# Altium project PowerPCB.PrjPcb
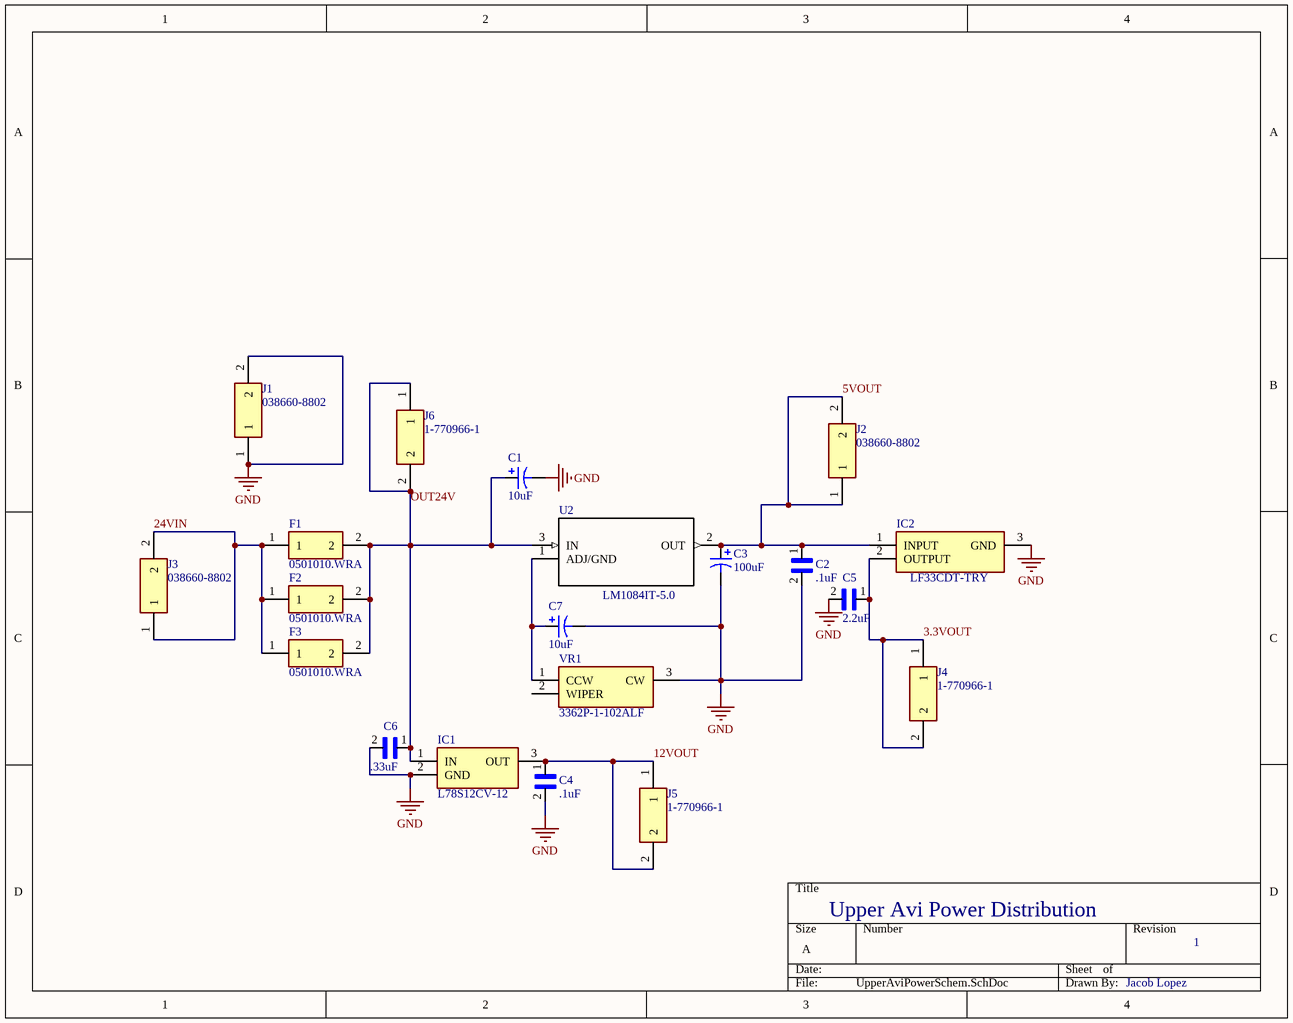
[diagram p0: UpperAviPowerSchem.SchDoc]
1 sheet, 20 parts. Net scope: global (net labels, ports and power ports of the same name join across sheets).
Board file: UpperAvi_3.PcbDoc

## Sheet UpperAviPowerSchem.SchDoc
size A

### Parts
C1  value 10uF  [CAPR5-4X5]  (hidden comment: Cap Pol3)
C2  .1uF  [6-0805_M]
C3  value 100uF  [CAPR5-4X5]  (hidden comment: Cap Pol3)
C4  .1uF  [6-0805_M]
C5  2.2uF  [6-0805_M]
C6  .33uF  [6-0805_M]
C7  value 10uF  [CAPR5-4X5]  (hidden comment: Cap Pol3)
F1  0501010.WRA  [FUSC3216X98N]
F2  0501010.WRA  [FUSC3216X98N]
F3  0501010.WRA  [FUSC3216X98N]
IC1  L78S12CV-12  [TO270P460X1020X2008-3P]
IC2  LF33CDT-TRY  [LD1117DT33]
J1  038660-8802  [0386608802]
J2  038660-8802  [0386608802]
J3  038660-8802  [0386608802]
J4  1-770966-1  [17709661]
J5  1-770966-1  [17709661]
J6  1-770966-1  [17709661]
U2  LM1084IT-5.0  [*TO254P470X1016X2222-3P]
VR1  3362P-1-102ALF  [3362P_1]

### Nets
GND: C1.2 C2.2 C3.2 C4.2 C5.2 C6.2 C7.2 IC1.2(GND) IC2.3(GND) J1.1 J1.2 VR1.3(CW)
3.3VOUT: C5.1 IC2.2(OUTPUT) J4.1 J4.2
5VOUT: C2.1 C3.1 IC2.1(INPUT) J2.1 J2.2 U2.2(OUT)
12VOUT: C4.1 IC1.3(OUT) J5.1 J5.2
24VIN: F1.1 F2.1 F3.1 J3.1 J3.2
OUT24V: C1.1 C6.1 F1.2 F2.2 F3.2 IC1.1(IN) J6.1 J6.2 U2.3(IN)
NetC7_1: C7.1 U2.1(ADJ/GND) VR1.1(CCW)

Not connected (* = marked no-connect by the designer): VR1 2(WIPER)

### Notes on the sheet
- Upper Avi Power Distribution
- 1
- Jacob Lopez

### Library data of the parts
C1 C3 C7 = Cap Pol3: Polarized Capacitor (Surface Mount); Published: 8-Jun-2000; LatestRevisionDate: 29-May-2009; LatestRevisionNote: IPC-7351 Footprint Added.; PackageReference: C0805; Publisher: Altium Limited; PackageDescription: Chip Capacitor
C2 C4-C6 = CC0603KRX7R9BB104: 0603 0.1 uF 50 V Â±10 % Tolerance X7R SMT Multilayer Ceramic Capacitor; MF: Yageo; Price: None; Availability: Unavailable; MP: CC0603KRX7R9BB104; Package: 0603 Yageo; SnapEDA_Link: https://www.snapeda.com/parts/CC0603KRX7R9BB104/Yageo/view-part/?ref=snap; Value: *
F1-F3 = 0501010.WRA: Fuse; Manufacturer_Name: LITTELFUSE; Datasheet Link: https://www.littelfuse.com/~/media/electronics/datasheets/fuses/littelfuse_fuse_501_datasheet.pdf.pdf; Height: 0.985mm; Manufacturer_Part_Number: 0501010.WRA; Mouser Part Number: 576-0501010.WRA; Mouser Price/Stock: https://www.mouser.com/Search/Refine.aspx?Keyword=576-0501010.WRA
IC1 = L78S12CV: Integrated Circuit; Manufacturer_Name: STMicroelectronics; Datasheet Link: https://componentsearchengine.com/Datasheets/1/L78S12CV.pdf; Height: 4.6mm; Mouser Part Number: 511-L78S12CV; Mouser Price/Stock: https://www.mouser.com/Search/Refine.aspx?Keyword=511-L78S12CV; Manufacturer_Part_Number: L78S12CV
IC2 = LF33CDT-TRY: Integrated Circuit; Manufacturer_Name: STMicroelectronics; Datasheet Link: https://componentsearchengine.com/Datasheets/1/LF33CDT-TRY.pdf; Height: 2mm; Mouser Part Number: 511-LF33CDT-TRY; Mouser Price/Stock: https://www.mouser.com/Search/Refine.aspx?Keyword=511-LF33CDT-TRY; Manufacturer_Part_Number: LF33CDT-TRY
J1-J3 = 038660-8802: Connector; Manufacturer_Name: Molex; Datasheet Link: https://www.molex.com/pdm_docs/sd/386608802_sd.pdf; Height: 21mm; Manufacturer_Part_Number: 038660-8802
J4-J6 = 1-770966-1: Connector; Manufacturer_Name: TE Connectivity; Allied_Number: 70084920; Datasheet Link: https://www.te.com/commerce/DocumentDelivery/DDEController?Action=showdoc&DocId=Customer+Drawing%7F770966%7FG1%7Fpdf%7FEnglish%7FENG_CD_770966_G1.pdf%7F1-770966-1; Height: 7.77mm; Manufacturer_Part_Number: 1-770966-1; Mouser Part Number: 571-1-770966-1; Mouser Price/Stock: https://www.mouser.com/Search/Refine.aspx?Keyword=571-1-770966-1; RS Part Number: 7099906; RS Price/Stock: https://uk.rs-online.com/web/p/products/7099906; Allied Price/Stock: https://www.alliedelec.com/teconnectivity-1-770966-1/70084920/
U2 = LM1084IT-5.0: Voltage stabiliser; LDO, fixed; 5V; 5A; TO220; THT; 1.2; MF: Texas Instruments; MP: LM1084IT-5.0/NOPB; SnapEDA_Link: https://www.snapeda.com/parts/LM1084IT-5.0/NOPB/Texas%20Instruments/view-part/?ref=snap; Availability: Unavailable; Price: None; Package: TO-220 Texas Instruments; Value: *
VR1 = 3362P-1-102ALF: Variable Resistor; Manufacturer_Name: Bourns; Datasheet Link: https://componentsearchengine.com/Datasheets/1/3362P-1-102ALF.pdf; Mouser Part Number: 652-3362P-1-102ALF; Mouser Price/Stock: https://www.mouser.com/Search/Refine.aspx?Keyword=652-3362P-1-102ALF; Manufacturer_Part_Number: 3362P-1-102ALF